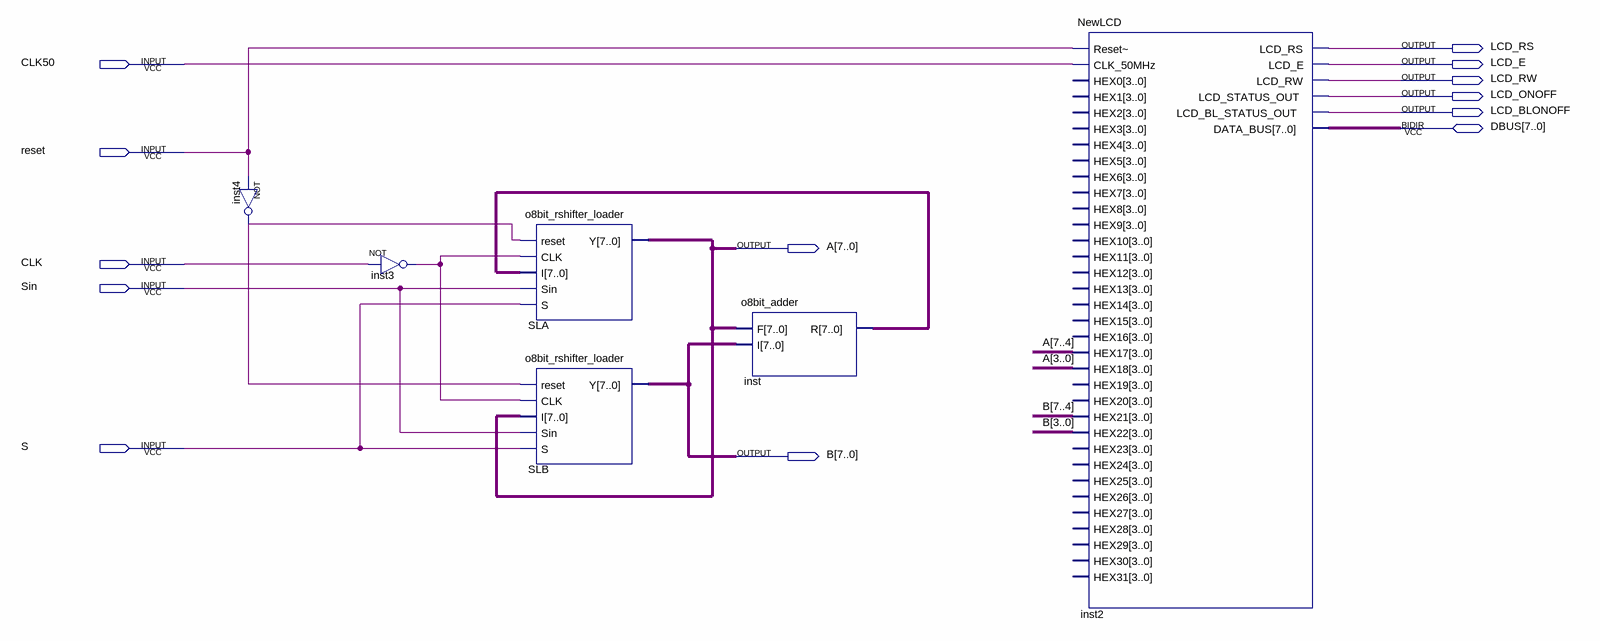
[diagram p0: schematic sheet]
// Quartus schematic Question2.bdf as structural Verilog: 6 symbols, 13 pins
module Question2 (
  input  CLK50,
  input  reset,
  input  CLK,
  input  Sin,
  input  S,
  inout  [7:0] DBUS,
  output LCD_RS,
  output LCD_E,
  output LCD_RW,
  output LCD_ONOFF,
  output LCD_BLONOFF,
  output [7:0] A,
  output [7:0] B
);

  wire inst3_out, inst4_out;
  wire [7:0] inst_r;

  not inst4 (inst4_out, reset);
  not inst3 (inst3_out, CLK);
  o8bit_rshifter_loader SLA (.reset(inst4_out), .CLK(inst3_out), .I(inst_r), .Sin(Sin), .S(S), .Y(A));
  o8bit_rshifter_loader SLB (.reset(inst4_out), .CLK(inst3_out), .I(A), .Sin(Sin), .S(S), .Y(B));
  o8bit_adder inst (.F(A), .I(B), .R(inst_r));
  NewLCD inst2 (
    .\Reset~ (reset), .CLK_50MHz(CLK50), .HEX17(A[7:4]), .HEX18(A[3:0]), .HEX21(B[7:4]), .HEX22(B[3:0]),
    .LCD_RS(LCD_RS), .LCD_E(LCD_E), .LCD_RW(LCD_RW), .LCD_STATUS_OUT(LCD_ONOFF),
    .LCD_BL_STATUS_OUT(LCD_BLONOFF), .DATA_BUS(DBUS));  // open: HEX0, HEX1, HEX2, HEX3, HEX4, HEX5, HEX6, HEX7, HEX8, HEX9, HEX10, HEX11, HEX12, HEX13, HEX14, HEX15, HEX16, HEX19, HEX20, HEX23, HEX24, HEX25, HEX26, HEX27, HEX28, HEX29, HEX30, HEX31
endmodule
